# EAGLE schematic arduino_adapter_sister (EAGLE 7.3.0)
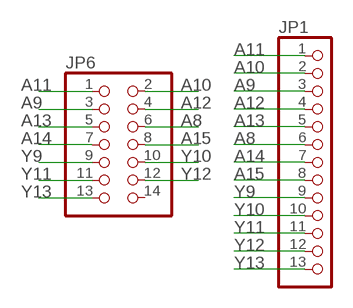
[diagram p0: schematic, sheet 1]

## Parts
JP1  PINHD-1X13  [1X13]
JP6  PINHD-2X7  [2X07]

## Nets
A8: JP1.6 JP6.6
A9: JP1.3 JP6.3
A10: JP1.2 JP6.2
A11: JP1.1 JP6.1
A12: JP1.4 JP6.4
A13: JP1.5 JP6.5
A14: JP1.7 JP6.7
A15: JP1.8 JP6.8
Y9: JP1.9 JP6.9
Y10: JP1.10 JP6.10
Y11: JP1.11 JP6.11
Y12: JP1.12 JP6.12
Y13: JP1.13 JP6.13
Unconnected: JP6.14

## Library data of the parts
JP1 = pinhead:PINHD-1X13: PIN HEADER
JP6 = pinhead:PINHD-2X7: PIN HEADER

## Net classes
1 vcc: width 0.254 mm